# Altium schematic sheet Embedded_Chip.SchDoc
size A; SheetNumber: 4; SheetTotal: 9
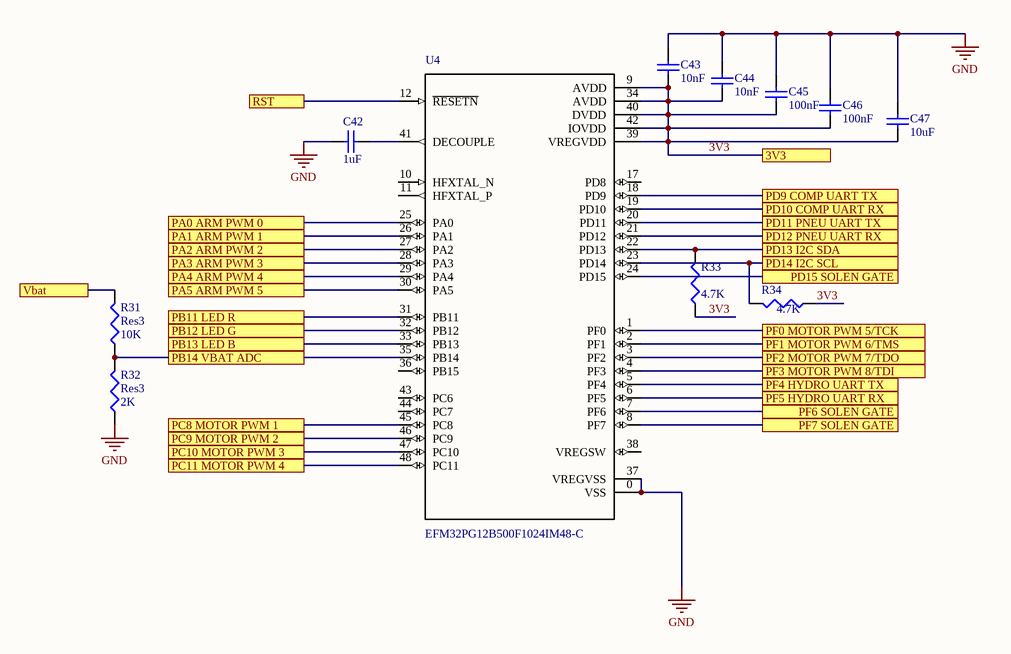
[diagram p0: Embedded_Chip.SchDoc]

## Parts
C42  value 1uF  [C1206]  (hidden comment: Cap Semi)
C43  value 10nF  [C1206]  (hidden comment: Cap Semi)
C44  value 10nF  [C1206]  (hidden comment: Cap Semi)
C45  value 100nF  [C1206]  (hidden comment: Cap Semi)
C46  value 100nF  [C1206]  (hidden comment: Cap Semi)
C47  value 10uF  [C1206]  (hidden comment: Cap Semi)
R31  Res3  value 10K  [J1-0603]
R32  Res3  value 2K  [J1-0603]
R33  value 4.7K  [J1-0603]  (hidden comment: Res3)
R34  value 4.7K  [J1-0603]  (hidden comment: Res3)
U4  EFM32PG12B500F1024IM48-C  [QFN50P700X700X90-49N]

## Ports
3V3, PA0 ARM PWM 0, PA1 ARM PWM 1, PA2 ARM PWM 2, PA3 ARM PWM 3, PA4 ARM PWM 4, PA5 ARM PWM 5, PB11 LED R, PB12 LED G, PB13 LED B, PB14 VBAT ADC, PC8 MOTOR PWM 1, PC9 MOTOR PWM 2, PC10 MOTOR PWM 3, PC11 MOTOR PWM 4, PD9 COMP UART TX, PD10 COMP UART RX, PD11 PNEU UART TX, PD12 PNEU UART RX, PD13 I2C SDA, PD14 I2C SCL, PD15 SOLEN GATE, PF0 MOTOR PWM 5/TCK, PF1 MOTOR PWM 6/TMS, PF2 MOTOR PWM 7/TDO, PF3 MOTOR PWM 8/TDI, PF4 HYDRO UART TX, PF5 HYDRO UART RX, PF6 SOLEN GATE, PF7 SOLEN GATE, RST, Vbat

## Nets
GND: C42.2 C43.1 C44.1 C45.1 C46.1 C47.1 R32.1 U4.0(VSS) U4.37(VREGVSS)
3V3: C43.2 C44.2 C45.2 C46.2 C47.2 R33.1 R34.1 U4.9(AVDD) U4.34(AVDD) U4.39(VREGVDD) U4.40(DVDD) U4.42(IOVDD) ; port 3V3
PA0 ARM PWM 0: U4.25(PA0) ; port PA0 ARM PWM 0
PA1 ARM PWM 1: U4.26(PA1) ; port PA1 ARM PWM 1
PA2 ARM PWM 2: U4.27(PA2) ; port PA2 ARM PWM 2
PA3 ARM PWM 3: U4.28(PA3) ; port PA3 ARM PWM 3
PA4 ARM PWM 4: U4.29(PA4) ; port PA4 ARM PWM 4
PA5 ARM PWM 5: U4.30(PA5) ; port PA5 ARM PWM 5
PB11 LED R: U4.31(PB11) ; port PB11 LED R
PB12 LED G: U4.32(PB12) ; port PB12 LED G
PB13 LED B: U4.33(PB13) ; port PB13 LED B
PB14 VBAT ADC: R31.1 R32.2 U4.35(PB14) ; port PB14 VBAT ADC
PC8 MOTOR PWM 1: U4.45(PC8) ; port PC8 MOTOR PWM 1
PC9 MOTOR PWM 2: U4.46(PC9) ; port PC9 MOTOR PWM 2
PC10 MOTOR PWM 3: U4.47(PC10) ; port PC10 MOTOR PWM 3
PC11 MOTOR PWM 4: U4.48(PC11) ; port PC11 MOTOR PWM 4
PD9 COMP UART TX: U4.18(PD9) ; port PD9 COMP UART TX
PD10 COMP UART RX: U4.19(PD10) ; port PD10 COMP UART RX
PD11 PNEU UART TX: U4.20(PD11) ; port PD11 PNEU UART TX
PD12 PNEU UART RX: U4.21(PD12) ; port PD12 PNEU UART RX
PD13 I2C SDA: R33.2 U4.22(PD13) ; port PD13 I2C SDA
PD14 I2C SCL: R34.2 U4.23(PD14) ; port PD14 I2C SCL
PD15 SOLEN GATE: U4.24(PD15) ; port PD15 SOLEN GATE
PF0 MOTOR PWM 5/TCK: U4.1(PF0) ; port PF0 MOTOR PWM 5/TCK
PF1 MOTOR PWM 6/TMS: U4.2(PF1) ; port PF1 MOTOR PWM 6/TMS
PF2 MOTOR PWM 7/TDO: U4.3(PF2) ; port PF2 MOTOR PWM 7/TDO
PF3 MOTOR PWM 8/TDI: U4.4(PF3) ; port PF3 MOTOR PWM 8/TDI
PF4 HYDRO UART TX: U4.5(PF4) ; port PF4 HYDRO UART TX
PF5 HYDRO UART RX: U4.6(PF5) ; port PF5 HYDRO UART RX
PF6 SOLEN GATE: U4.7(PF6) ; port PF6 SOLEN GATE
PF7 SOLEN GATE: U4.8(PF7) ; port PF7 SOLEN GATE
RST: U4.12(~{RESETN}) ; port RST
Vbat: R31.2 ; port Vbat
NetC42_1: C42.1 U4.41(DECOUPLE)

Not connected (* = marked no-connect by the designer): U4 10(HFXTAL_N) 11(HFXTAL_P) 17(PD8) 36(PB15) 38(VREGSW) 43(PC6) 44(PC7)

## Library data of the parts
C42-C47 = Cap Semi: Capacitor (Semiconductor SIM Model); Published: 8-Jun-2000; LatestRevisionDate: 29-May-2009; LatestRevisionNote: IPC-7351 Footprint Added.; PackageReference: C1206; Publisher: Altium Limited; PackageDescription: Chip Capacitor
R31-R34 = Res3: Resistor; Published: 8-Jun-2000; LatestRevisionDate: 29-May-2009; LatestRevisionNote: IPC-7351 Footprint Added.; PackageReference: J1-0603; Publisher: Altium Limited; PackageDescription: Chip Resistor
U4 = EFM32PG12B500F1024IM48-C: ARM® Cortex®-M4 Pearl Gecko Microcontroller IC 32-Bit 40MHz 1MB (1M x 8) FLASH 48-QFN (7x7); MP: EFM32PG12B500F1024GM48-B; MF: Silicon Labs; Package: QFN-48 Silicon Labs; Price: None; Availability: Unavailable; SnapEDA_Link: https://www.snapeda.com/parts/EFM32PG12B500F1024GM48-B/Silicon%20Labs/view-part/?ref=snap; Value: *; ComponentLink1Description: Digi-Key; ComponentLink1URL: https://www.digikey.com/product-detail/en/silicon-labs/EFM32PG12B500F1024IM48-C/336-5333-ND/8161157